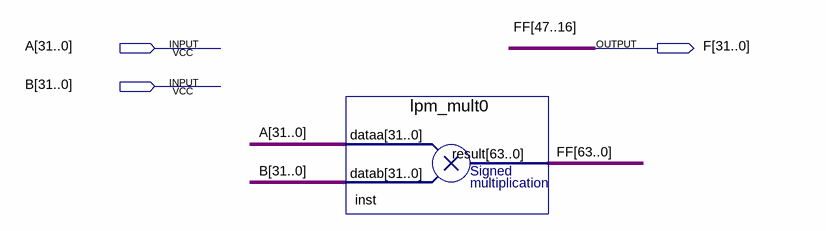
[diagram p0: schematic sheet]
// Quartus schematic real_mul.bdf as structural Verilog: 1 symbols, 3 pins
module real_mul (
  input  [31:0] A,
  input  [31:0] B,
  output [31:0] F
);

  wire [63:0] FF;

  lpm_mult0 inst (.dataa(A), .datab(B), .result({FF[63:48], F, FF[15:0]}));

  // Other names for the same wires on the sheet: FF[47:16] = F
endmodule
